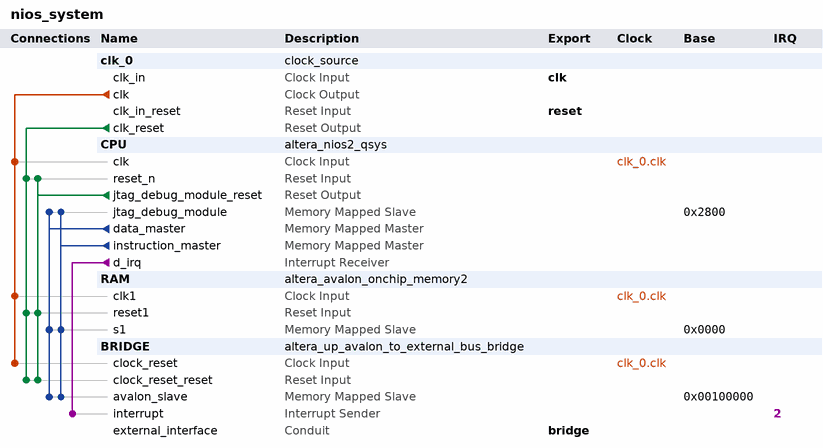
[diagram p0: system contents]
# Platform Designer (Qsys) system nios_system, Cyclone II EP2C35F672C6
# Parameters at their usual value, and those the tool derives, are not listed.
package require -exact qsys 13.0
create_system nios_system
set_project_property DEVICE_FAMILY {Cyclone II}
set_project_property DEVICE EP2C35F672C6

add_instance clk_0 clock_source 13.0
set_instance_parameter_value clk_0 clockFrequency 50000000

add_instance CPU altera_nios2_qsys 13.0
set_instance_parameter_value CPU resetSlave RAM.s1
set_instance_parameter_value CPU mmu_TLBMissExcSlave None
set_instance_parameter_value CPU exceptionSlave RAM.s1
set_instance_parameter_value CPU breakSlave CPU.jtag_debug_module
set_instance_parameter_value CPU impl Small
set_instance_parameter_value CPU icache_size 4096

add_instance RAM altera_avalon_onchip_memory2 13.0.1.99.2
set_instance_parameter_value RAM dataWidth 32
set_instance_parameter_value RAM dualPort false
set_instance_parameter_value RAM initMemContent true
set_instance_parameter_value RAM initializationFileName onchip_mem.hex
set_instance_parameter_value RAM memorySize 8192

add_instance BRIDGE altera_up_avalon_to_external_bus_bridge 13.0
set_instance_parameter_value BRIDGE addr_size 1024
set_instance_parameter_value BRIDGE addr_size_multiplier Kbytes
set_instance_parameter_value BRIDGE data_size 16

# connections
add_connection clk_0.clk BRIDGE.clock_reset clock
add_connection clk_0.clk CPU.clk clock
add_connection clk_0.clk RAM.clk1 clock
add_connection clk_0.clk_reset BRIDGE.clock_reset_reset reset
add_connection clk_0.clk_reset CPU.reset_n reset
add_connection clk_0.clk_reset RAM.reset1 reset
add_connection CPU.jtag_debug_module_reset BRIDGE.clock_reset_reset reset
add_connection CPU.jtag_debug_module_reset CPU.reset_n reset
add_connection CPU.jtag_debug_module_reset RAM.reset1 reset
add_connection CPU.data_master BRIDGE.avalon_slave avalon
set_connection_parameter_value CPU.data_master/BRIDGE.avalon_slave baseAddress 0x00100000
add_connection CPU.data_master CPU.jtag_debug_module avalon
set_connection_parameter_value CPU.data_master/CPU.jtag_debug_module baseAddress 0x2800
add_connection CPU.data_master RAM.s1 avalon
set_connection_parameter_value CPU.data_master/RAM.s1 baseAddress 0x0000
add_connection CPU.instruction_master BRIDGE.avalon_slave avalon
set_connection_parameter_value CPU.instruction_master/BRIDGE.avalon_slave baseAddress 0x00100000
add_connection CPU.instruction_master CPU.jtag_debug_module avalon
set_connection_parameter_value CPU.instruction_master/CPU.jtag_debug_module baseAddress 0x2800
add_connection CPU.instruction_master RAM.s1 avalon
set_connection_parameter_value CPU.instruction_master/RAM.s1 baseAddress 0x0000
add_connection CPU.d_irq BRIDGE.interrupt interrupt
set_connection_parameter_value CPU.d_irq/BRIDGE.interrupt irqNumber 2

# exported interfaces
add_interface clk clock sink
set_interface_property clk EXPORT_OF clk_0.clk_in
add_interface reset reset sink
set_interface_property reset EXPORT_OF clk_0.clk_in_reset
add_interface bridge conduit end
set_interface_property bridge EXPORT_OF BRIDGE.external_interface

set_interconnect_requirement {$system} qsys_mm.clockCrossingAdapter HANDSHAKE
set_interconnect_requirement {$system} qsys_mm.maxAdditionalLatency 1

save_system nios_system.qsys
